# Altium schematic sheet 00_Block_Diagram.SchDoc
size A3; SheetNumber: 3; SheetTotal: 4
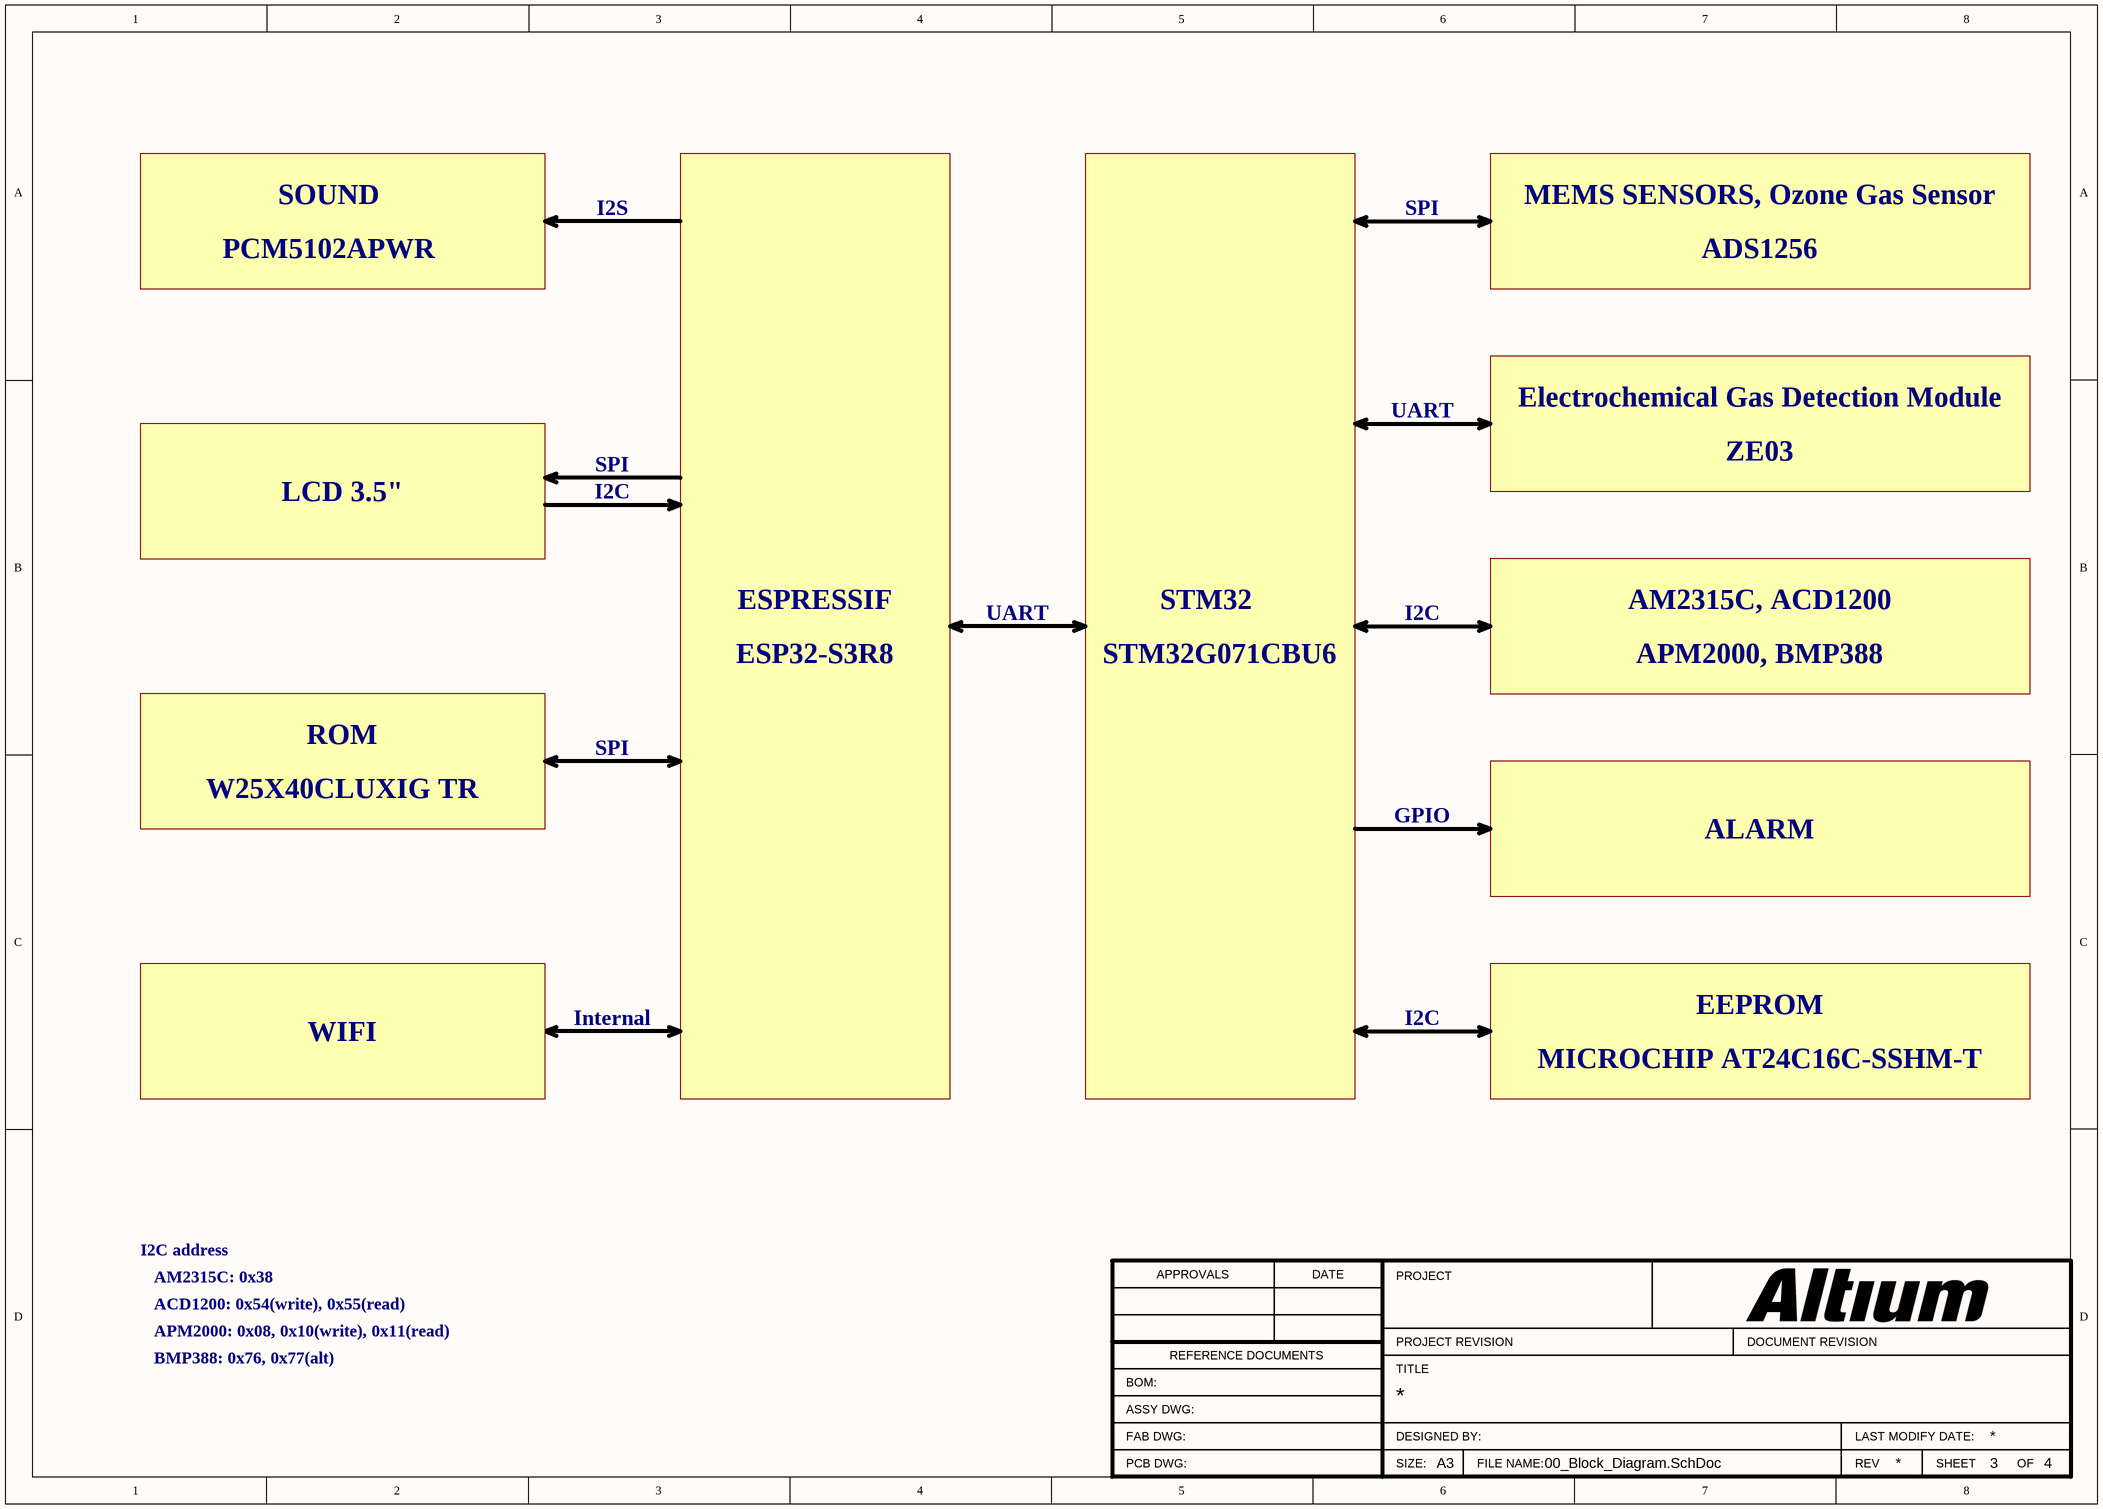
[diagram p0: 00_Block_Diagram.SchDoc]

## Notes on the sheet
- SOUND
- PCM5102APWR
- I2S
- SPI
- MEMS SENSORS, Ozone Gas Sensor
- ADS1256
- UART
- ZE03
- Electrochemical Gas Detection Module
- LCD 3.5"
- I2C
- ESP32-S3R8
- ESPRESSIF
- STM32
- STM32G071CBU6
- AM2315C, ACD1200
- APM2000, BMP388
- ROM
- W25X40CLUXIG TR
- GPIO
- ALARM
- WIFI
- Internal
- MICROCHIP AT24C16C-SSHM-T
- EEPROM
- I2C address
- AM2315C: 0x38
- ACD1200: 0x54(write), 0x55(read)
- APM2000: 0x08, 0x10(write), 0x11(read)
- BMP388: 0x76, 0x77(alt)
- PROJECT
- APPROVALS
- DATE
- BOM:
- REFERENCE DOCUMENTS
- TITLE
- PROJECT REVISION
- DOCUMENT REVISION
- ASSY DWG:
- FAB DWG:
- PCB DWG:
- SIZE:
- DESIGNED BY:
- A3
- FILE NAME:
- REV
- LAST MODIFY DATE:
- SHEET
- OF